# EAGLE design pCog102_Wifi_PSPJoy_BLED_TFT (EAGLE 6.6.0)

## Sheet 1 of 4
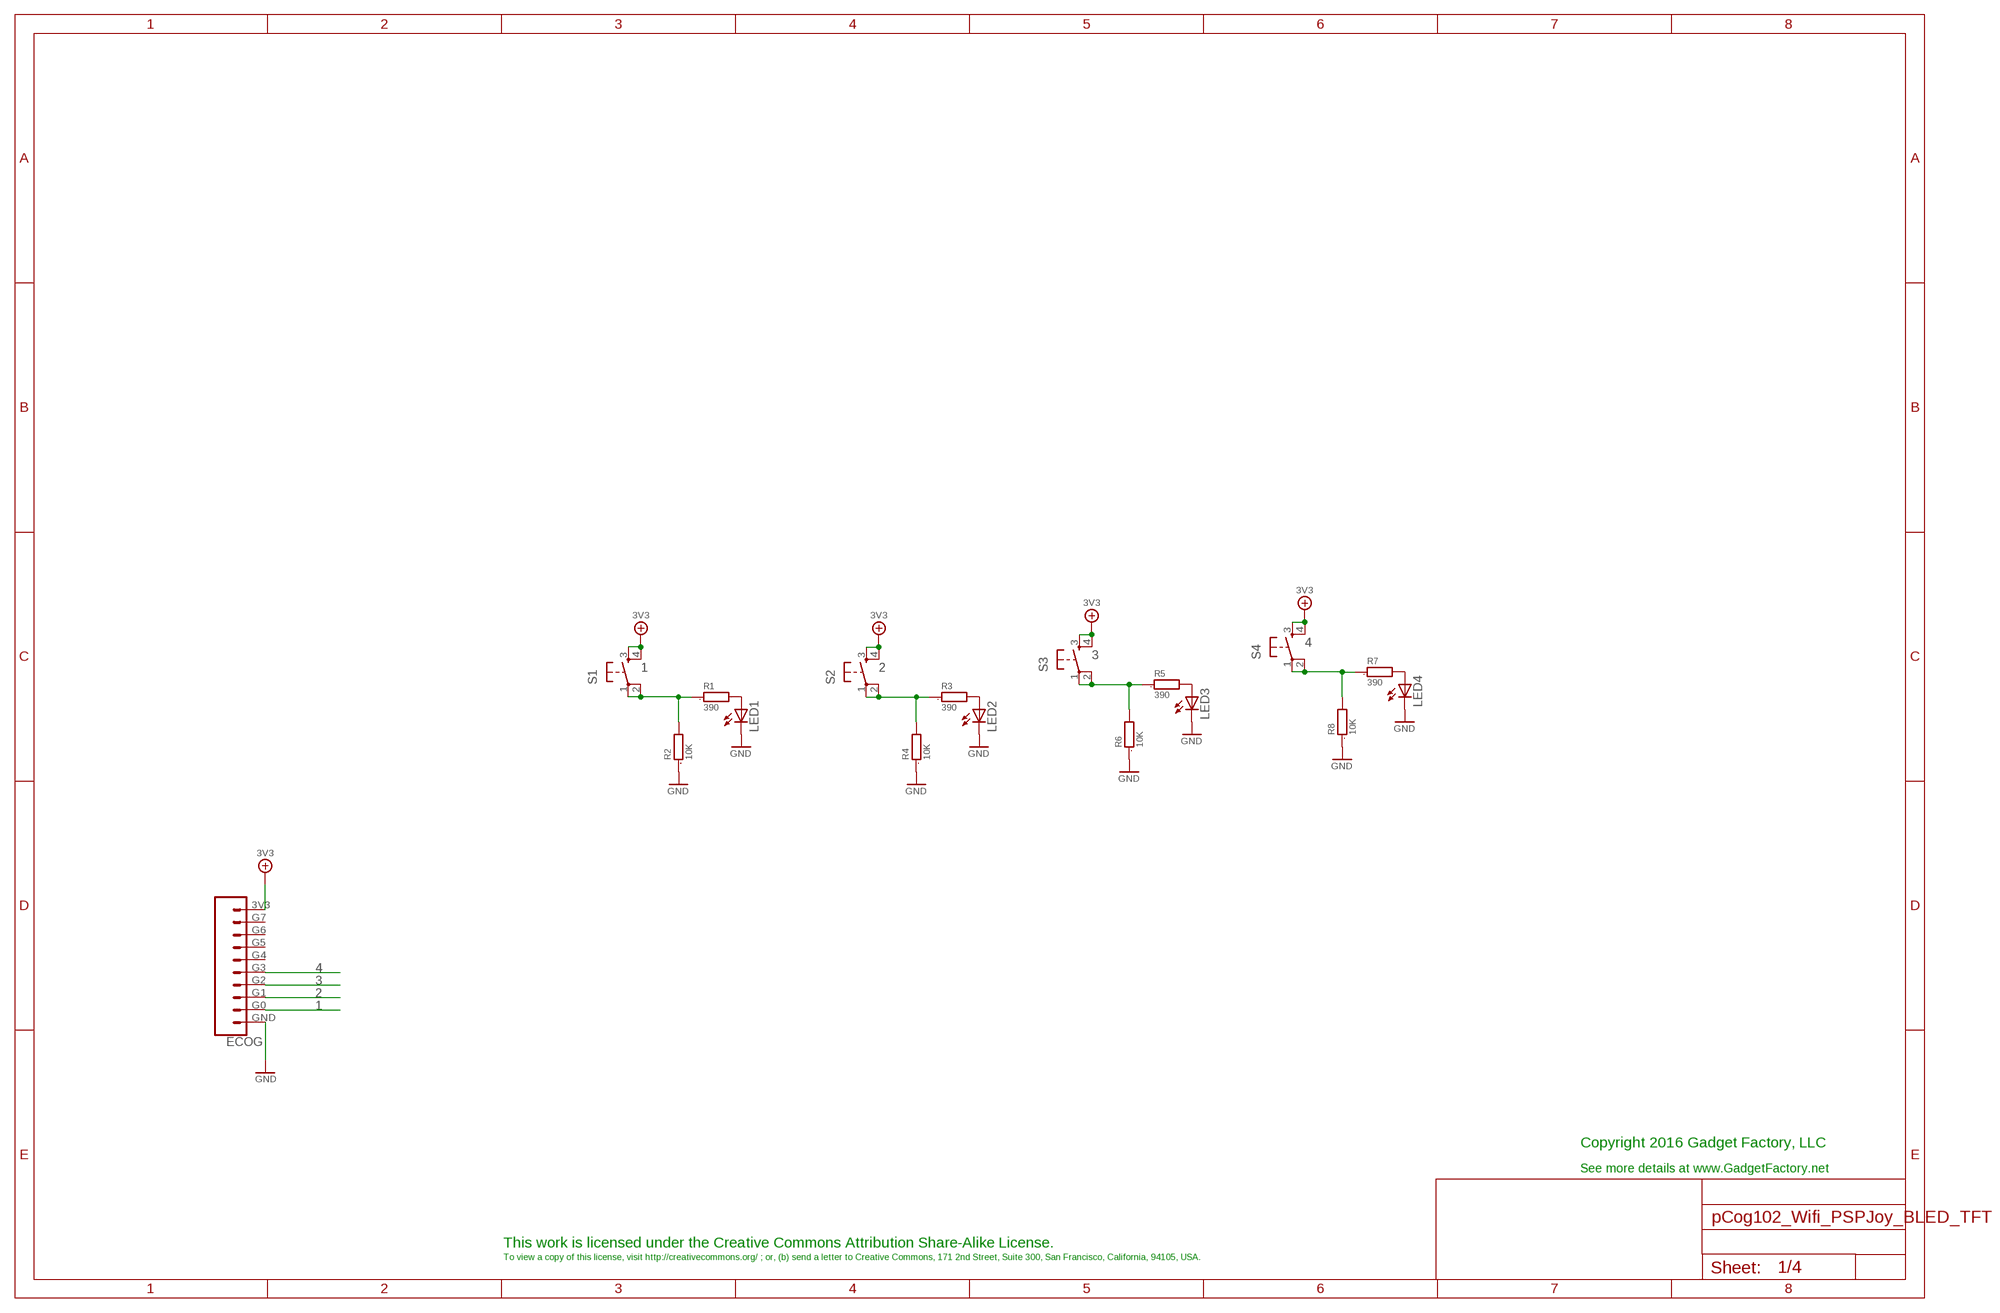
[diagram p0: schematic, sheet 1]

### Parts
ECOG  ECOG_GENERAL_ROWECOG_GENERAL_SMD  [ECOG_GENERAL_SMD]
LED1  LEDCHIP-LED0805  [CHIP-LED0805]
LED2  LEDCHIP-LED0805  [CHIP-LED0805]
LED3  LEDCHIP-LED0805  [CHIP-LED0805]
LED4  LEDCHIP-LED0805  [CHIP-LED0805]
R1  390  R0805  [0805]
R2  10K  R0805  [0805]
R3  390  R0805  [0805]
R4  10K  R0805  [0805]
R5  390  R0805  [0805]
R6  10K  R0805  [0805]
R7  390  R0805  [0805]
R8  10K  R0805  [0805]
S1  TAC_SWITCHPTH  [TACTILE-PTH]
S2  TAC_SWITCHPTH  [TACTILE-PTH]
S3  TAC_SWITCHPTH  [TACTILE-PTH]
S4  TAC_SWITCHPTH  [TACTILE-PTH]

### Nets
1: ECOG.G0 R1.1 R2.2 S1.1 S1.2
2: ECOG.G1 R3.1 R4.2 S2.1 S2.2
3: ECOG.G2 R5.1 R6.2 S3.1 S3.2
3V3: ECOG.3V3 S1.3 S1.4 S2.3 S2.4 S3.3 S3.4 S4.3 S4.4 ; also sheet 2,3,4
4: ECOG.G3 R7.1 R8.2 S4.1 S4.2
GND: ECOG.GND LED1.C LED2.C LED3.C LED4.C R2.1 R4.1 R6.1 R8.1 ; also sheet 2,3,4
N$1: LED1.A R1.2
N$2: LED2.A R3.2
N$3: LED3.A R5.2
N$4: LED4.A R7.2
Unconnected: ECOG.G4 ECOG.G5 ECOG.G6 ECOG.G7

### Notes on the sheet
- Copyright 2016 Gadget Factory, LLC
- See more details at www.GadgetFactory.net
- This work is licensed under the Creative Commons Attribution Share-Alike License.
- To view a copy of this license, visit http://creativecommons.org/ ; or, (b) send a letter to Creative Commons, 171 2nd Street, Suite 300, San Francisco, California, 94105, USA.

## Sheet 2 of 4
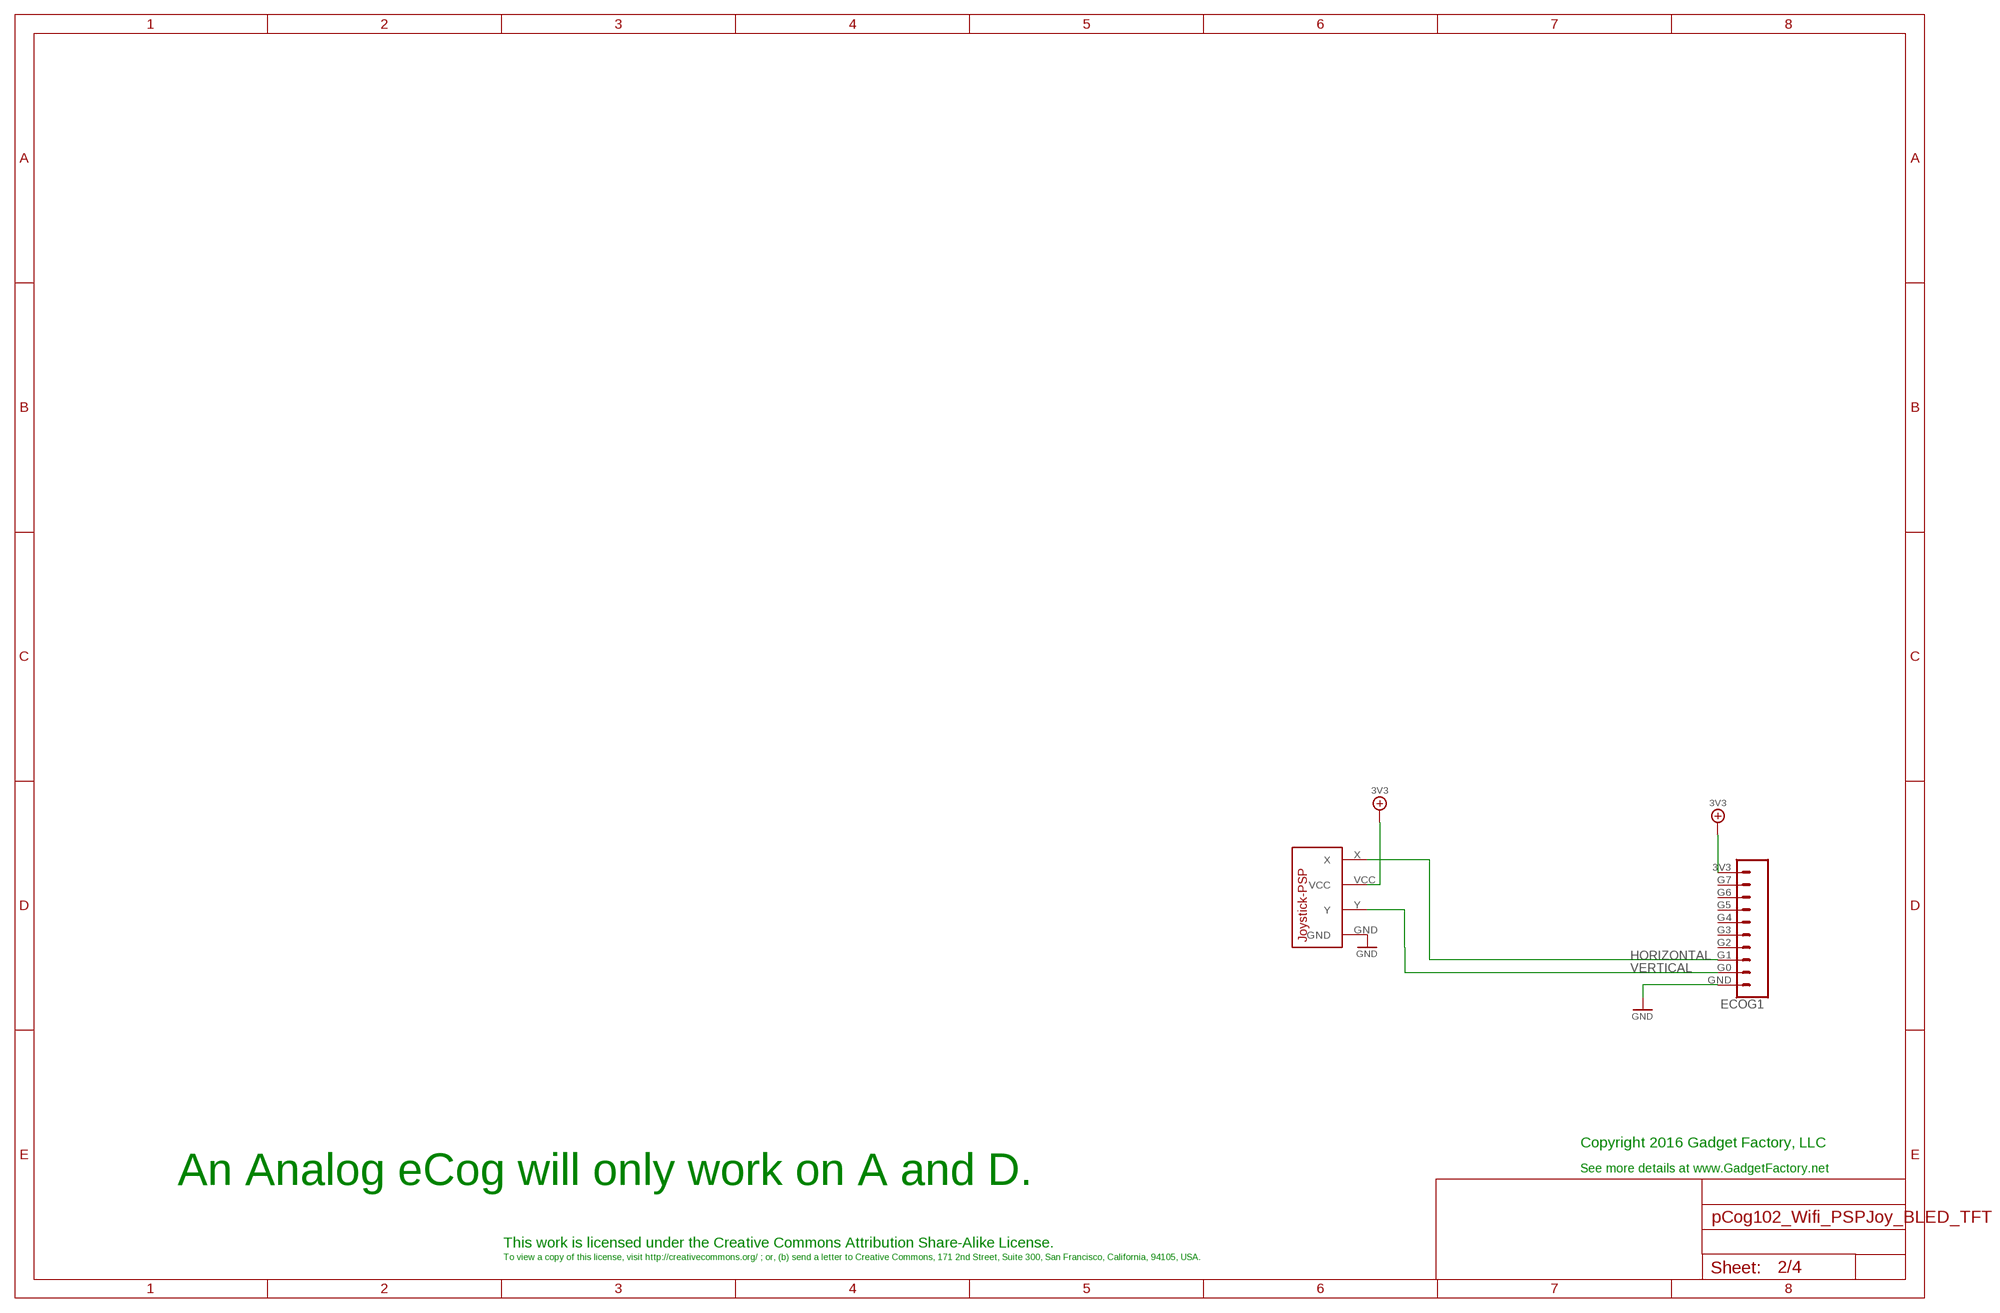
[diagram p1: schematic, sheet 2]

### Parts
ECOG1  ECOG_GENERAL_ROWECOG_GENERAL_SMD  [ECOG_GENERAL_SMD]
U$7  JOYSTICK-PSP1000  [JOYSTICK-PSP1000]

### Nets
3V3: ECOG1.3V3 U$7.VCC ; also sheet 1,3,4
GND: ECOG1.GND U$7.GND ; also sheet 1,3,4
HORIZONTAL: ECOG1.G1 U$7.X
VERTICAL: ECOG1.G0 U$7.Y
Unconnected: ECOG1.G2 ECOG1.G3 ECOG1.G4 ECOG1.G5 ECOG1.G6 ECOG1.G7

### Notes on the sheet
- Copyright 2016 Gadget Factory, LLC
- See more details at www.GadgetFactory.net
- An Analog eCog will only work on A and D.
- This work is licensed under the Creative Commons Attribution Share-Alike License.
- To view a copy of this license, visit http://creativecommons.org/ ; or, (b) send a letter to Creative Commons, 171 2nd Street, Suite 300, San Francisco, California, 94105, USA.

## Sheet 3 of 4
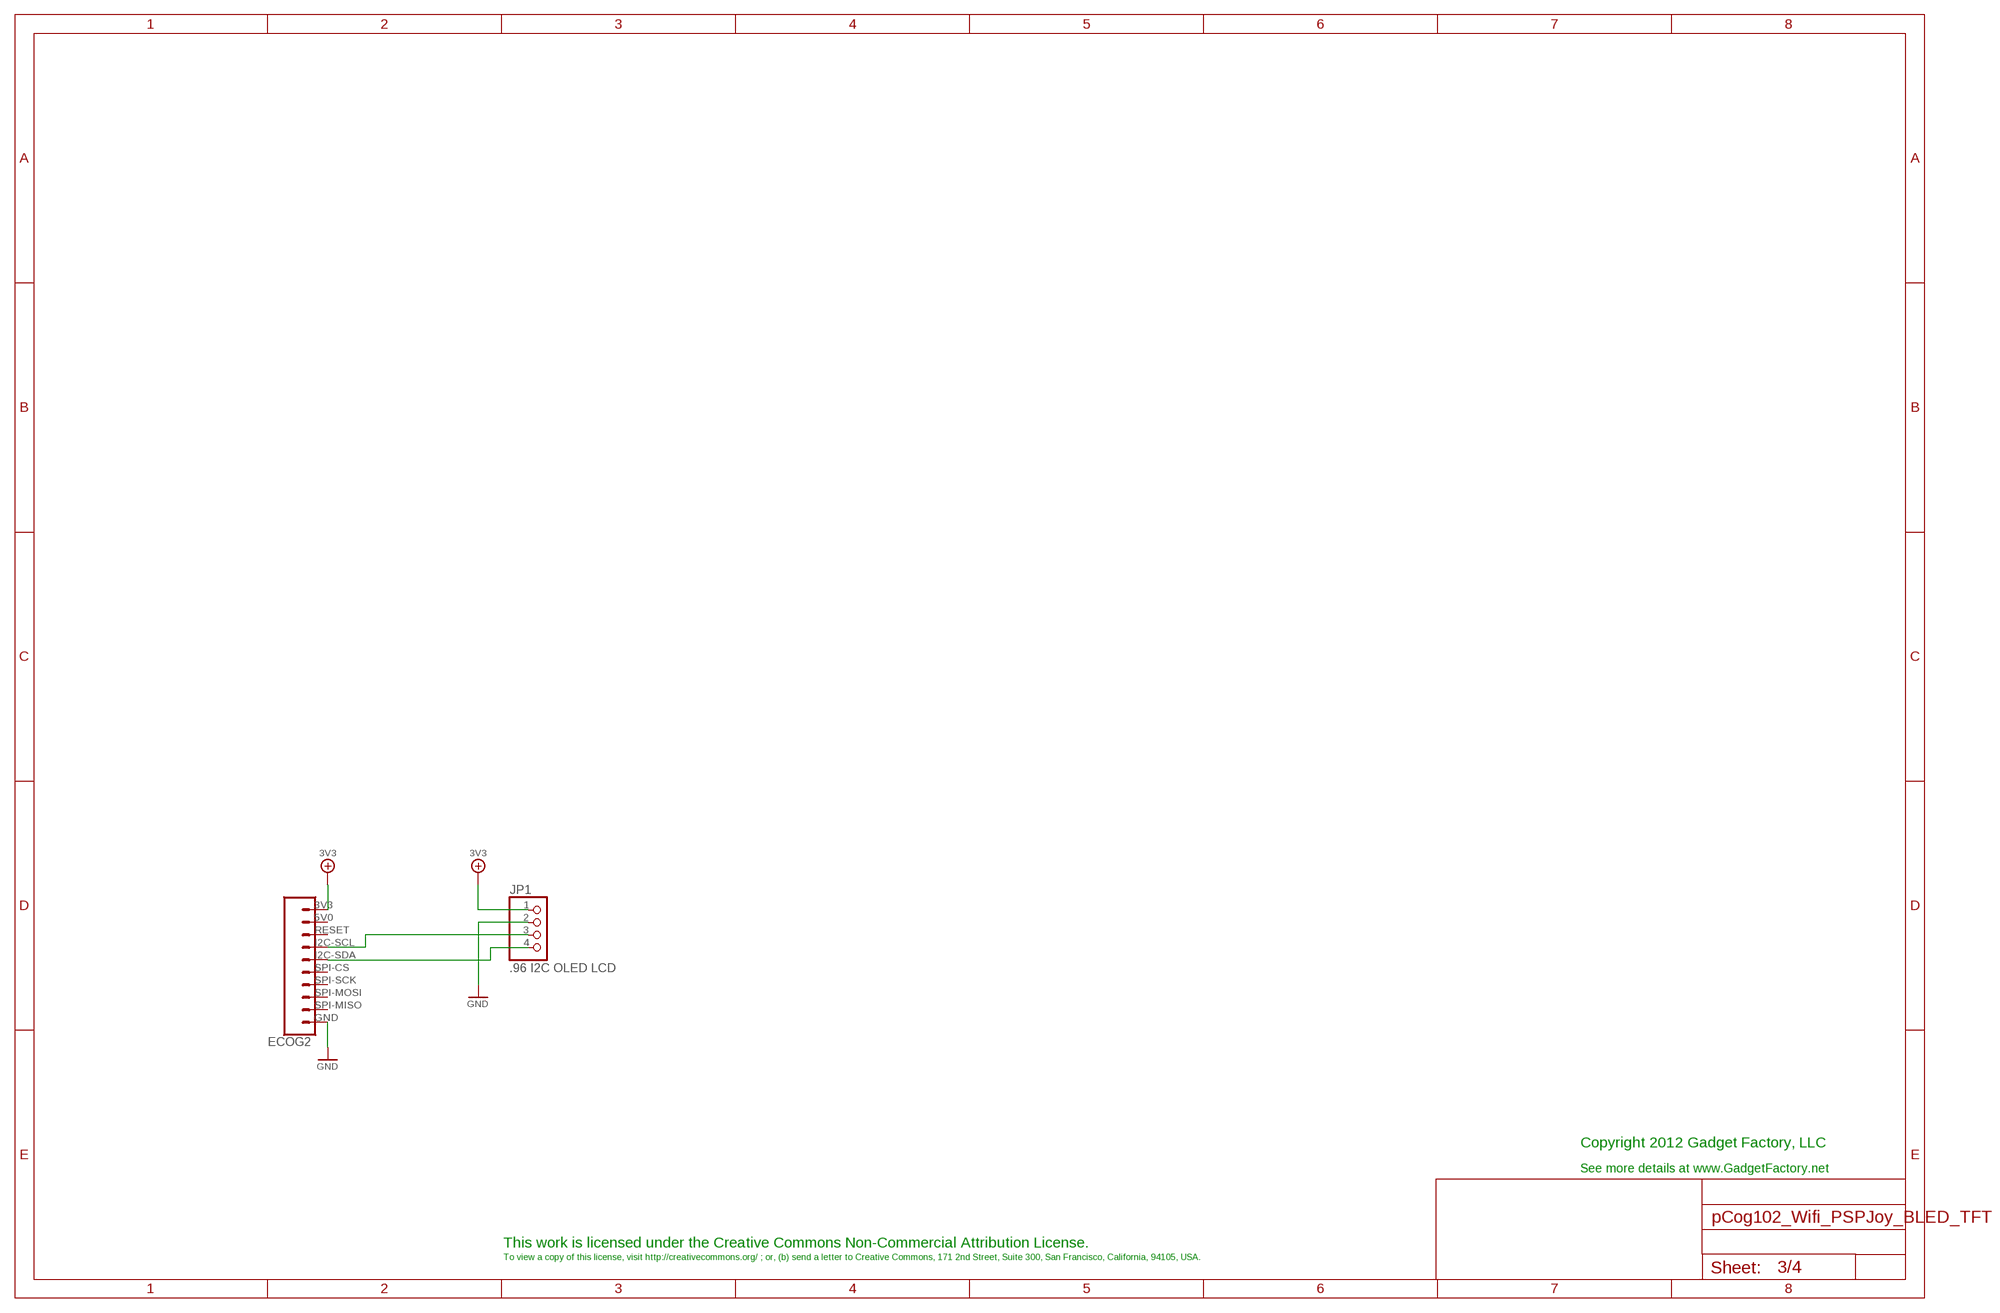
[diagram p2: schematic, sheet 3]

### Parts
ECOG2  ECOG_BUSES_ROWECOG_BUSES_SMD  [ECOG_BUSES_SMD]
JP1  .96 I2C OLED LCD  PINHD-1X4  [1X04]

### Nets
3V3: ECOG2.3V3 JP1.1 ; also sheet 1,2,4
GND: ECOG2.GND JP1.2 ; also sheet 1,2,4
N$7: ECOG2.I2C-SDA JP1.4
N$8: ECOG2.I2C-SCL JP1.3
Unconnected: ECOG2.5V0 ECOG2.RESET ECOG2.SPI-CS ECOG2.SPI-MISO ECOG2.SPI-MOSI ECOG2.SPI-SCK

### Notes on the sheet
- Copyright 2012 Gadget Factory, LLC
- See more details at www.GadgetFactory.net
- This work is licensed under the Creative Commons Non-Commercial Attribution License.
- To view a copy of this license, visit http://creativecommons.org/ ; or, (b) send a letter to Creative Commons, 171 2nd Street, Suite 300, San Francisco, California, 94105, USA.

## Sheet 4 of 4
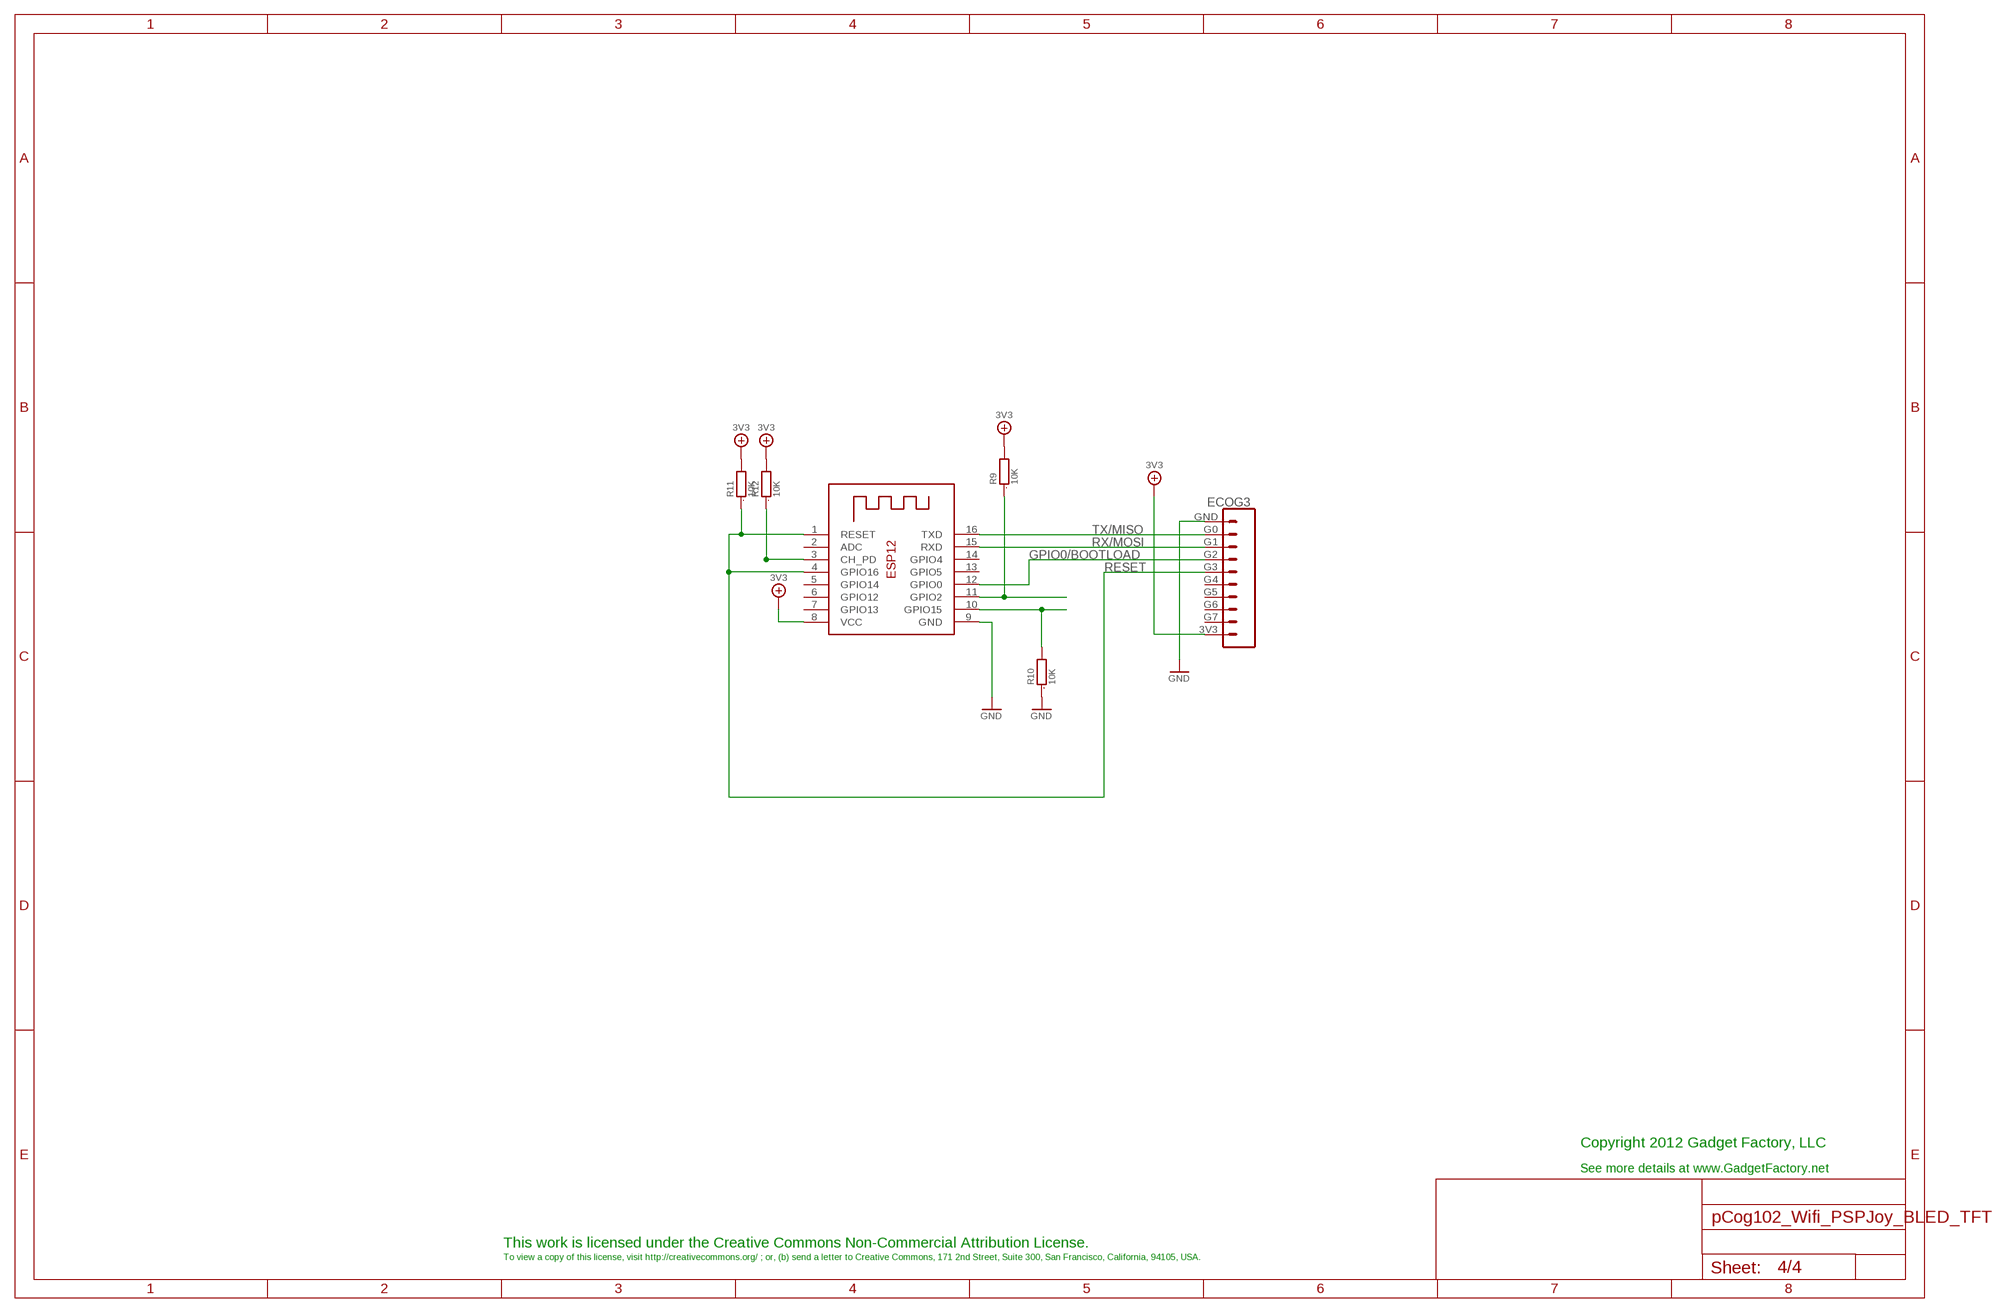
[diagram p3: schematic, sheet 4]

### Parts
ECOG3  ECOG_GENERAL_ROWECOG_GENERAL_SMD  [ECOG_GENERAL_SMD]
R9  10K  R0805  [0805]
R10  10K  R0805  [0805]
R11  10K  R0805  [0805]
R12  10K  R0805  [0805]
X1  ESP-12  [ESP-12]

### Nets
3V3: ECOG3.3V3 R9.2 R11.2 R12.2 X1.8(VCC) ; also sheet 1,2,3
GND: ECOG3.GND R10.1 X1.9(GND) ; also sheet 1,2,3
GPIO0/BOOTLOAD: ECOG3.G2 X1.12(GPIO0)
N$9: R9.1 X1.11(GPIO2)
N$10: R10.2 X1.10(GPIO15)
N$11: R12.1 X1.3(CH_PD)
RESET: ECOG3.G3 R11.1 X1.1(RESET) X1.4(GPIO16)
RX/MOSI: ECOG3.G1 X1.15(RXD)
TX/MISO: ECOG3.G0 X1.16(TXD)
Unconnected: ECOG3.G4 ECOG3.G5 ECOG3.G6 ECOG3.G7 X1.2(ADC) X1.5(GPIO14) X1.6(GPIO12) X1.7(GPIO13) X1.13(GPIO5) X1.14(GPIO4)

### Notes on the sheet
- Copyright 2012 Gadget Factory, LLC
- See more details at www.GadgetFactory.net
- This work is licensed under the Creative Commons Non-Commercial Attribution License.
- To view a copy of this license, visit http://creativecommons.org/ ; or, (b) send a letter to Creative Commons, 171 2nd Street, Suite 300, San Francisco, California, 94105, USA.

## Library data of the parts
ECOG ECOG1 ECOG3 = eCogs:ECOG_GENERAL_ROW; DIGIKEY: S1013EC-10-ND
ECOG2 = eCogs:ECOG_BUSES_ROW; DIGIKEY: S1013EC-10-ND
JP1 = pinhead:PINHD-1X4: PIN HEADER; DEALEXTREME: 419232
LED1-LED4 = adafruit:LED: LED OSRAM: - CHIPLED LG R971, LG N971, LY N971, LG Q971, LY Q971, LO R971, LY R971 LH N974, LH R974 LS Q976, LO Q976, LY Q976 LO Q996 - Hyper CHIPLED LW Q18S LB Q993, LB Q99A, LB R99A - SideLED LS A670, LO A670, LY A670, LG A670, LP A670 LB A673, LV A673, LT A673, LW A673 LH A674 LY A675 LS A676, LA A676, LO A676, LY A676, LW A676 LS A679, LY A679, LG A679 - Hyper Micro SIDELED® LS Y876, LA Y876, LO Y876, LY Y876 LT Y87S - SmartLED LW L88C, LW L88S LB L89C, LB L89S, LG L890 LS L89K, LO L89K, LY L89K LS L896, LA L896, LO L896, LY L896 - TOPLED LS T670, LO T670, LY T670, LG T670, LP T670 LSG T670, LSP T670, LSY T670, LOP T670, LYG T670 LG T671, LOG T671, LSG T671 LB T673, LV T673, LT T673, LW T673 LH T674 LS T676, LA T676, LO T676, LY T676, LB T676, LH T676, LSB T676, LW T676 LB T67C, LV T67C, LT T67C, LS T67K, LO T67K, LY T67K, LW E67C LS E67B, LA E67B, LO E67B, LY E67B, LB E67C, LV E67C, LT E67C LW T67C LS T679, LY T679, LG T679 LS T770, LO T770, LY T770, LG T770, LP T770 LB T773, LV T773, LT T773, LW T773 LH T774 LS E675, LA E675, LY E675, LS T675 LS T776, LA T776, LO T776, LY T776, LB T776 LHGB T686 LT T68C, LB T68C - Hyper Mini TOPLED® LB M676 - Mini TOPLED Santana® LG M470 LS M47K, LO M47K, LY M47K Source: http://www.osram.convergy.de/; DIGIKEY: 475-1410-2-ND
R1 R3 R5 R7 = GadgetFactory:R: RESISTOR, European symbol; DIGIKEY: RMCF0805JT390RCT-ND
R2 R4 R6 R8-R12 = GadgetFactory:R: RESISTOR, European symbol; DIGIKEY: RMCF0805JT10K0CT-ND
S1-S4 = SparkFun:TAC_SWITCH: Momentary Switch Button commonly used for reset or general input. Spark Fun Electronics SKU : COM-00097; DIGIKEY: 679-2428-ND
U$7 = SparkFun:JOYSTICK-PSP1000: This is a footprint for the PSP-1000 Joystick. 4-pins: X, Y, Vcc and GND; SPARKFUN: COM-09426
X1 = adafruit:ESP-12; ADAFRUIT: 2491

## Board
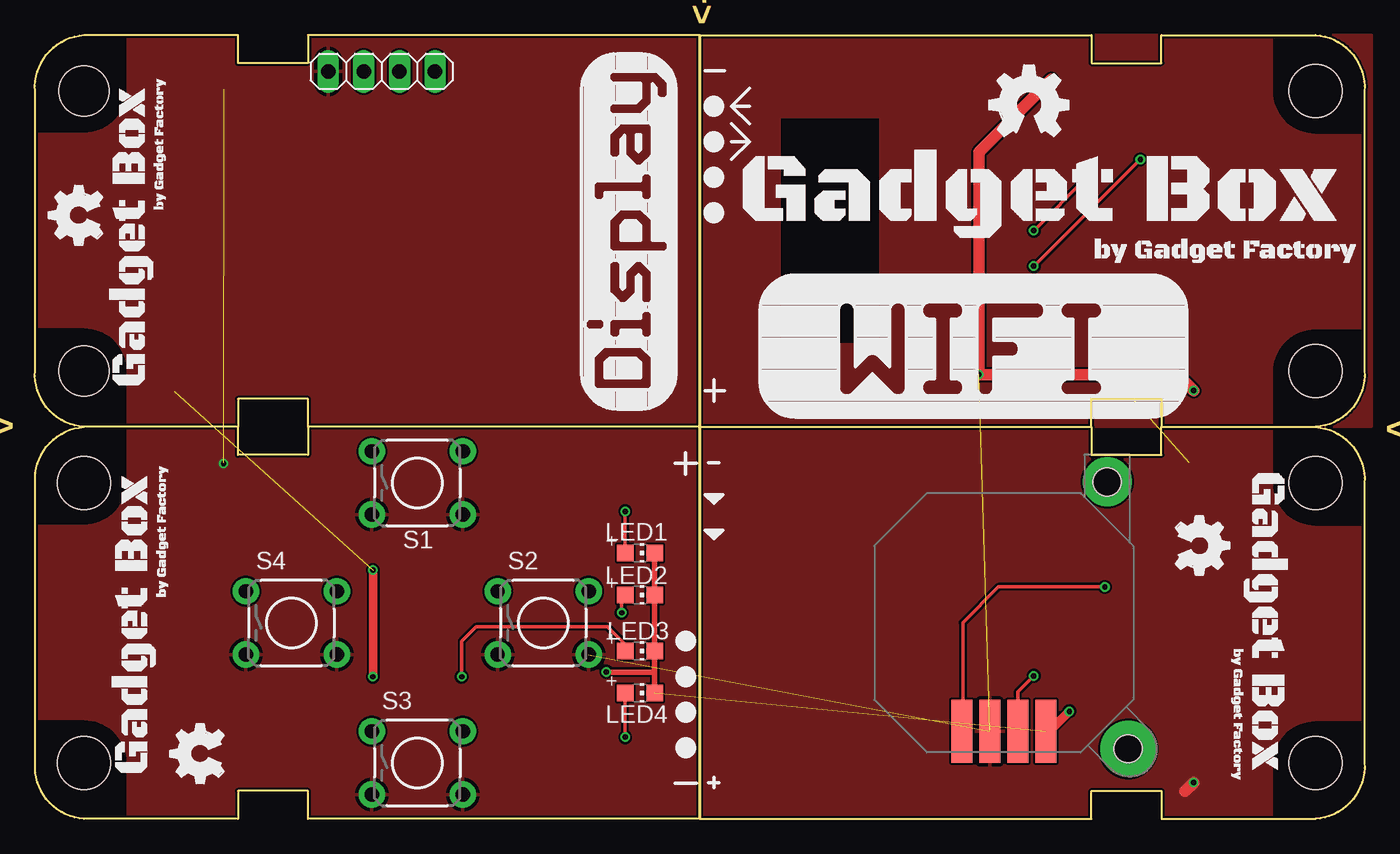
[diagram p4: board, top side]
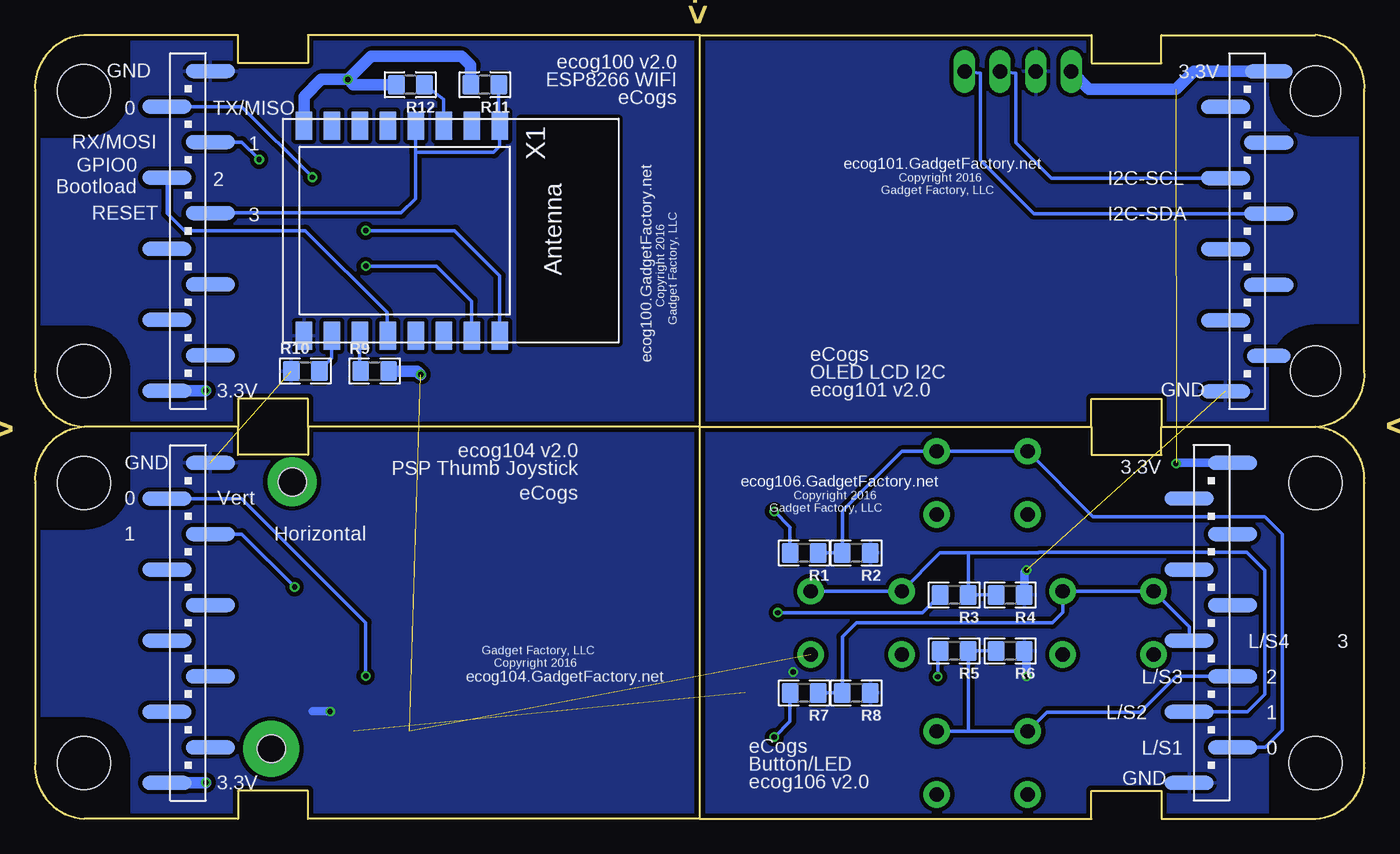
[diagram p5: board, bottom side, seen from below]

Size 95.01 x 56 mm. Coordinates in mm from the lower left corner, seen from the top.
Copper layers (1*16): Top 0.035mm / dielectric 1.5mm / Bottom 0.035mm
Design rules "hackvana": minimum track width 6mil, minimum drill 0.3mm, track to track 6mil, track to pad 6mil, pad to pad 6mil, via to via 6mil, smd to smd 0mil, copper to edge 6mil, drill to drill 6mil, minimum pad ring 10mil, minimum via ring 6mil, stop-mask expansion 2mil, vias tented up to drill 100mil, thermal gap 10mil

### Footprints (pad centres in the part's own frame; a part is rotated, then mirrored left to right if it is on the bottom)
ECOG_GENERAL_SMD = smd 3.5 x 1 bottom: 3V3 9.923,25.429; G0 9.923,5.111; G1 13.022,7.649; G2 9.923,10.189; G3 13.022,12.729; G4 9.923,15.269; G5 13.022,17.809; G6 9.923,20.349; G7 13.022,22.889; GND 13.022,2.571 | hole 3.8: 4,24; 4,4
ECOG_BUSES_SMD = smd 3.4 x 1 bottom: 3V3 7.337,25.4 | smd 3.5 x 1 bottom: 5V0 10.436,22.86; GND 10.436,2.54; I2C-SCL 10.436,17.78; I2C-SDA 7.337,15.24; RESET 7.337,20.32; SPI-CS 10.436,12.7; SPI-MOSI 10.436,7.62; SPI-SCK 7.337,10.16 | smd 3.1 x 1 bottom: SPI-MISO 7.337,5.08 | hole 3.6: 4.004,24.003; 4.004,4.003
1X04 = drill 1.016 long: 1 -3.81,0; 2 -1.27,0; 3 1.27,0; 4 3.81,0
CHIP-LED0805 = smd 1.2 x 1.2: A 0,-1.05; C 0,1.05
0805 = smd 1.2 x 1.4: 1 -1,0; 2 1,0
TACTILE-PTH = drill 1.016 pad 1.88: 1 -3.251,2.261; 2 3.251,2.261; 3 -3.251,-2.261; 4 3.251,-2.261
JOYSTICK-PSP1000 = smd 1.5 x 4.5: GND -3,7.75; VCC 1,7.75; X 3,7.75; Y -1,7.75 | hole 2: -8.89,8.985; -7.375,-10.06
ESP-12 = smd 2 x 1.2: 1 -7.5,4.5; 2 -7.5,2.5; 3 -7.5,0.5; 4 -7.5,-1.5; 5 -7.5,-3.5; 6 -7.5,-5.5; 7 -7.5,-7.5; 8 -7.5,-9.5; 9 7.5,-9.5; 10 7.5,-7.5; 11 7.5,-5.5; 12 7.5,-3.5; 13 7.5,-1.5; 14 7.5,0.5; 15 7.5,2.5; 16 7.5,4.5

### Placement (x,y rotation side)
ECOG  -0.49,0 0 top
ECOG1  95.51,28 180 top
ECOG2  -0.5,28 0 top
ECOG3  95.51,56 180 top
JP1  24.77,53.4 0 top
LED1  43.24,19 270 top
LED2  43.24,16 270 top
LED3  43.24,12 270 top
LED4  43.24,9 270 top
R1  40.05,19 180 bottom
R2  36.32,19 180 bottom
R3  29.32,16 180 bottom
R4  25.32,16 180 bottom
R5  29.32,12 180 bottom
R6  25.32,12 180 bottom
R7  40.05,9 180 bottom
R8  36.32,9 180 bottom
R9  70.74,32 0 bottom
R10  75.69,32 0 bottom
R11  62.87,52.44 180 bottom
R12  68.2,52.44 180 bottom
S1  27.32,24 0 top
S2  36.32,14 0 top
S3  27.32,4 0 top
S4  18.32,14 0 top
U$1  [LEGEND_DIO]  46.5,12.7 0 top
U$2  [LEGEND_DIO]  46.5,10.16 0 top
U$3  [LEGEND_DIO]  46.5,7.62 0 top
U$4  [LEGEND_DIO]  46.5,5.08 0 top
U$5  [GADGETBOX_SMALL]  7.13,13.97 90 top
U$6  [OSHW_FILLX150_NOTEXT]  13.48,2.54 90 top
U$7  69.24,14 180 top
U$8  [LEGEND_ANALOG]  48.52,22.92 180 top
U$9  [LEGEND_ANALOG]  48.52,20.38 180 top
U$10  [GADGETBOX_SMALL]  87.89,14.03 270 top
U$11  [OSHW_FILLX150_NOTEXT]  81.54,21.65 270 top
U$12  [GADGETBOX_SMALL]  6.95,41.65 90 top
U$13  [OSHW_FILLX150_NOTEXT]  4.8,41 90 top
U$14  [GADGETBOX_TEXT]  71.88,44.44 0 top
U$15  [LEGEND_DIO]  48.52,43.3 180 top
U$16  [LEGEND_DIO]  48.52,45.84 180 top
U$17  [LEGEND_DIO]  48.52,48.38 180 top
U$18  [LEGEND_DIO]  48.52,50.92 180 top
U$19  [OSHW_FILLX200_NOTEXT]  68.2,48.76 0 top
X1  66.3,42.03 270 bottom

### Tracks (layer width: path | path; a pad name or v marks a point on that pad's centre or on a via)
1
  Bottom 0.254: R1.1 R2.2 37.32,22 33.06,26.26 S1.2 S1.1 19.4,21.59 7.13,21.59 5.86,20.32 5.86,6.35 7.1,5.11 ECOG.G0
2
  Bottom 0.254: R4.2 R3.1 28.32,19 | 28.32,19 23.32,19 23.27,19.05 8.4,19.05 7.13,17.78 7.13,8.89 8.37,7.65 ECOG.G1 | 28.32,19 30.33,19 S2.1 S2.2
3
  Bottom 0.254: R6.2 R5.1 28.32,6.26 | S3.2 28.32,6.26 | 28.32,6.26 S3.1 22.71,7.62 16.02,7.62 13.45,10.19 ECOG.G2
3V3  (via drill 0.38)  (3 unrouted)
  Top 0.813: v82.81,2.6 82.17,1.96 | v72.65,52.82 67.44,47.62 v67.44,31.74 81.66,31.74 v82.81,30.6
  Bottom 0.61: ECOG.3V3 13.45,25.43 v13.48,25.4
  Bottom 0.813: ECOG1.3V3 82.83,2.57 v82.81,2.6 | ECOG2.3V3 12.2,53.4 13.47,52.13 19.69,52.13 JP1.1 | 75.89,49.62 X1.8 75.8,51.58 74.55,52.82 v72.65,52.82 | R12.2 72.26,52.44 v72.65,52.82 | R11.2 63.87,53.82 64.52,54.48 70.99,54.48 v72.65,52.82 | R9.2 67.69,32 v67.44,31.74 | v82.81,30.6 85.55,30.6 ECOG3.3V3
  pour Top: -1.49,29 48.51,29 48.51,-1 -1.49,-1
  pour Top: 96.78,-1.27 46.24,-1.27 46.24,29.27 96.78,29.27
  pour Top: -1.77,57.27 48.77,57.27 48.77,26.73 -1.77,26.73
4
  Bottom 0.254: R7.1 R8.2 37.32,13 36.32,14 22.32,14 21.57,14.75 S4.2 S4.1 12.53,13.72 ECOG.G3
GND  (via drill 0.38)  (3 unrouted)
  Top 0.406: LED1.C LED2.C LED3.C 44.29,10.48 | 44.29,10.48 LED4.C | 44.29,10.48 40.86,10.48 v40.84,10.5
  Top 0.61: v24.15,17.78 v24.15,10.16 | U$7.GND 72.49,6.25 v73.92,7.68
  Bottom 0.61: R4.1 24.32,17.61 v24.15,17.78 | v24.15,10.16 24.15,11.83 R6.1 | v73.92,7.68 75.19,7.68
  pour Bottom (isolate 0.305): -2.49,30 49.51,30 49.51,-2 -2.49,-2
  pour Bottom (isolate 0.305): 98.05,-2.54 44.97,-2.54 44.97,30.54 98.05,30.54
  pour Bottom (isolate 0.305): -3.04,58.54 50.04,58.54 50.04,25.46 -3.04,25.46
  pour Bottom (isolate 0.305): 95.51,28 47.51,28 47.51,56 95.51,56
  pour Top: 95.51,28.06 47.25,28.06 47.25,56 95.51,56
GPIO0/BOOTLOAD
  Bottom 0.254: X1.12 69.85,34.59 69.85,36.19 75.69,42.03 84.33,42.03 85.58,43.28 ECOG3.G2
HORIZONTAL  (via drill 0.38)
  Top 0.254: v76.46,16.57 68.84,16.57 66.3,14.03 66.3,6.31 U$7.X
  Bottom 0.254: ECOG1.G1 80.24,20.35 v76.46,16.57
N$1  (via drill 0.38)
  Top 0.254: v42.18,21.97 LED1.A
  Bottom 0.254: R1.2 41.05,20.84 v42.18,21.97
N$2  (via drill 0.38)
  Top 0.254: v41.93,14.73 41.93,15.74 LED2.A
  Bottom 0.254: v41.93,14.73 31.59,14.73 R3.2
N$3  (via drill 0.38)
  Top 0.254: LED3.A 42.63,12 40.91,13.72 31.51,13.72 30.5,12.7 v30.5,10.16
  Bottom 0.254: v30.5,10.16 30.5,11.82 R5.2
N$4  (via drill 0.38)
  Top 0.254: v42.18,5.84 LED4.A
  Bottom 0.254: R7.2 41.05,6.97 v42.18,5.84
N$5  (via drill 2 pad 4)
  other vias: 78.14,5
N$6  (via drill 2 pad 3.5)
  other vias: 76.64,24.1
N$7
  Bottom 0.254: ECOG2.I2C-SDA 23.63,43.24 27.44,47.05 27.44,53.27 JP1.4
N$8
  Bottom 0.254: ECOG2.I2C-SCL 22.36,45.78 24.9,48.32 24.9,53.27 JP1.3
N$9
  Bottom 0.254: X1.11 71.8,32.05 R9.1
N$10
  Bottom 0.254: X1.10 73.8,32.89 R10.2
N$11
  Bottom 0.254: X1.3 65.8,51.42 R12.1
RESET
  Bottom 0.254: 67.82,47.62 67.82,49.51 X1.4 | R11.1 61.87,49.6 X1.1 61.8,48.05 62.23,47.62 67.82,47.62 | 67.82,47.62 67.82,44.32 68.84,43.3 82.45,43.3 ECOG3.G3
RX/MOSI  (via drill 0.38)
  Top 0.254: v79,47.11 v71.38,39.49
  Bottom 0.254: 63.76,34.49 X1.15 63.8,36.99 66.3,39.49 v71.38,39.49 | ECOG3.G1 80.24,48.35 v79,47.11
TX/MISO  (via drill 0.38)
  Top 0.254: v75.19,45.84 v71.38,42.03
  Bottom 0.254: 61.98,34.35 X1.16 61.8,38.8 65.03,42.03 v71.38,42.03 | ECOG3.G0 80.23,50.89 v75.19,45.84
VERTICAL  (via drill 0.38)
  Top 0.254: U$7.Y 70.24,9.08 v71.38,10.22
  Bottom 0.254: ECOG1.G0 80.23,22.89 71.38,14.03 v71.38,10.22

### Text on the board
Dimension: <---vScore | vScore----> | <---vScore | vScore---->
bPlace: ecog100 v2.0 | GND | 3.3V | ESP8266 WIFI | eCogs | TX/MISO | 0 | 1 | RX/MOSI | GPIO0 / Bootload | Copyright 2016 | ecog101.GadgetFactory.net | 2 | I2C-SCL | Gadget Factory, LLC | 3 | RESET | I2C-SDA | Copyright 2016 | Gadget Factory, LLC | eCogs | ecog100.GadgetFactory.net | OLED LCD I2C | 3.3V | GND | ecog101 v2.0 | ecog104 v2.0 | PSP Thumb Joystick | GND | 3.3V | ecog106.GadgetFactory.net | eCogs | Copyright 2016 | Vert | 0 | Gadget Factory, LLC | Horizontal | 1 | 3 | L/S4 | Gadget Factory, LLC | ecog104.GadgetFactory.net | Copyright 2016 | 2 | L/S3 | 1 | L/S2 | 0 | L/S1 | eCogs | Button/LED | 3.3V | GND | ecog106 v2.0